# Altium schematic sheet Power.SchDoc
size A3; SheetNumber: 1; SheetTotal: 4
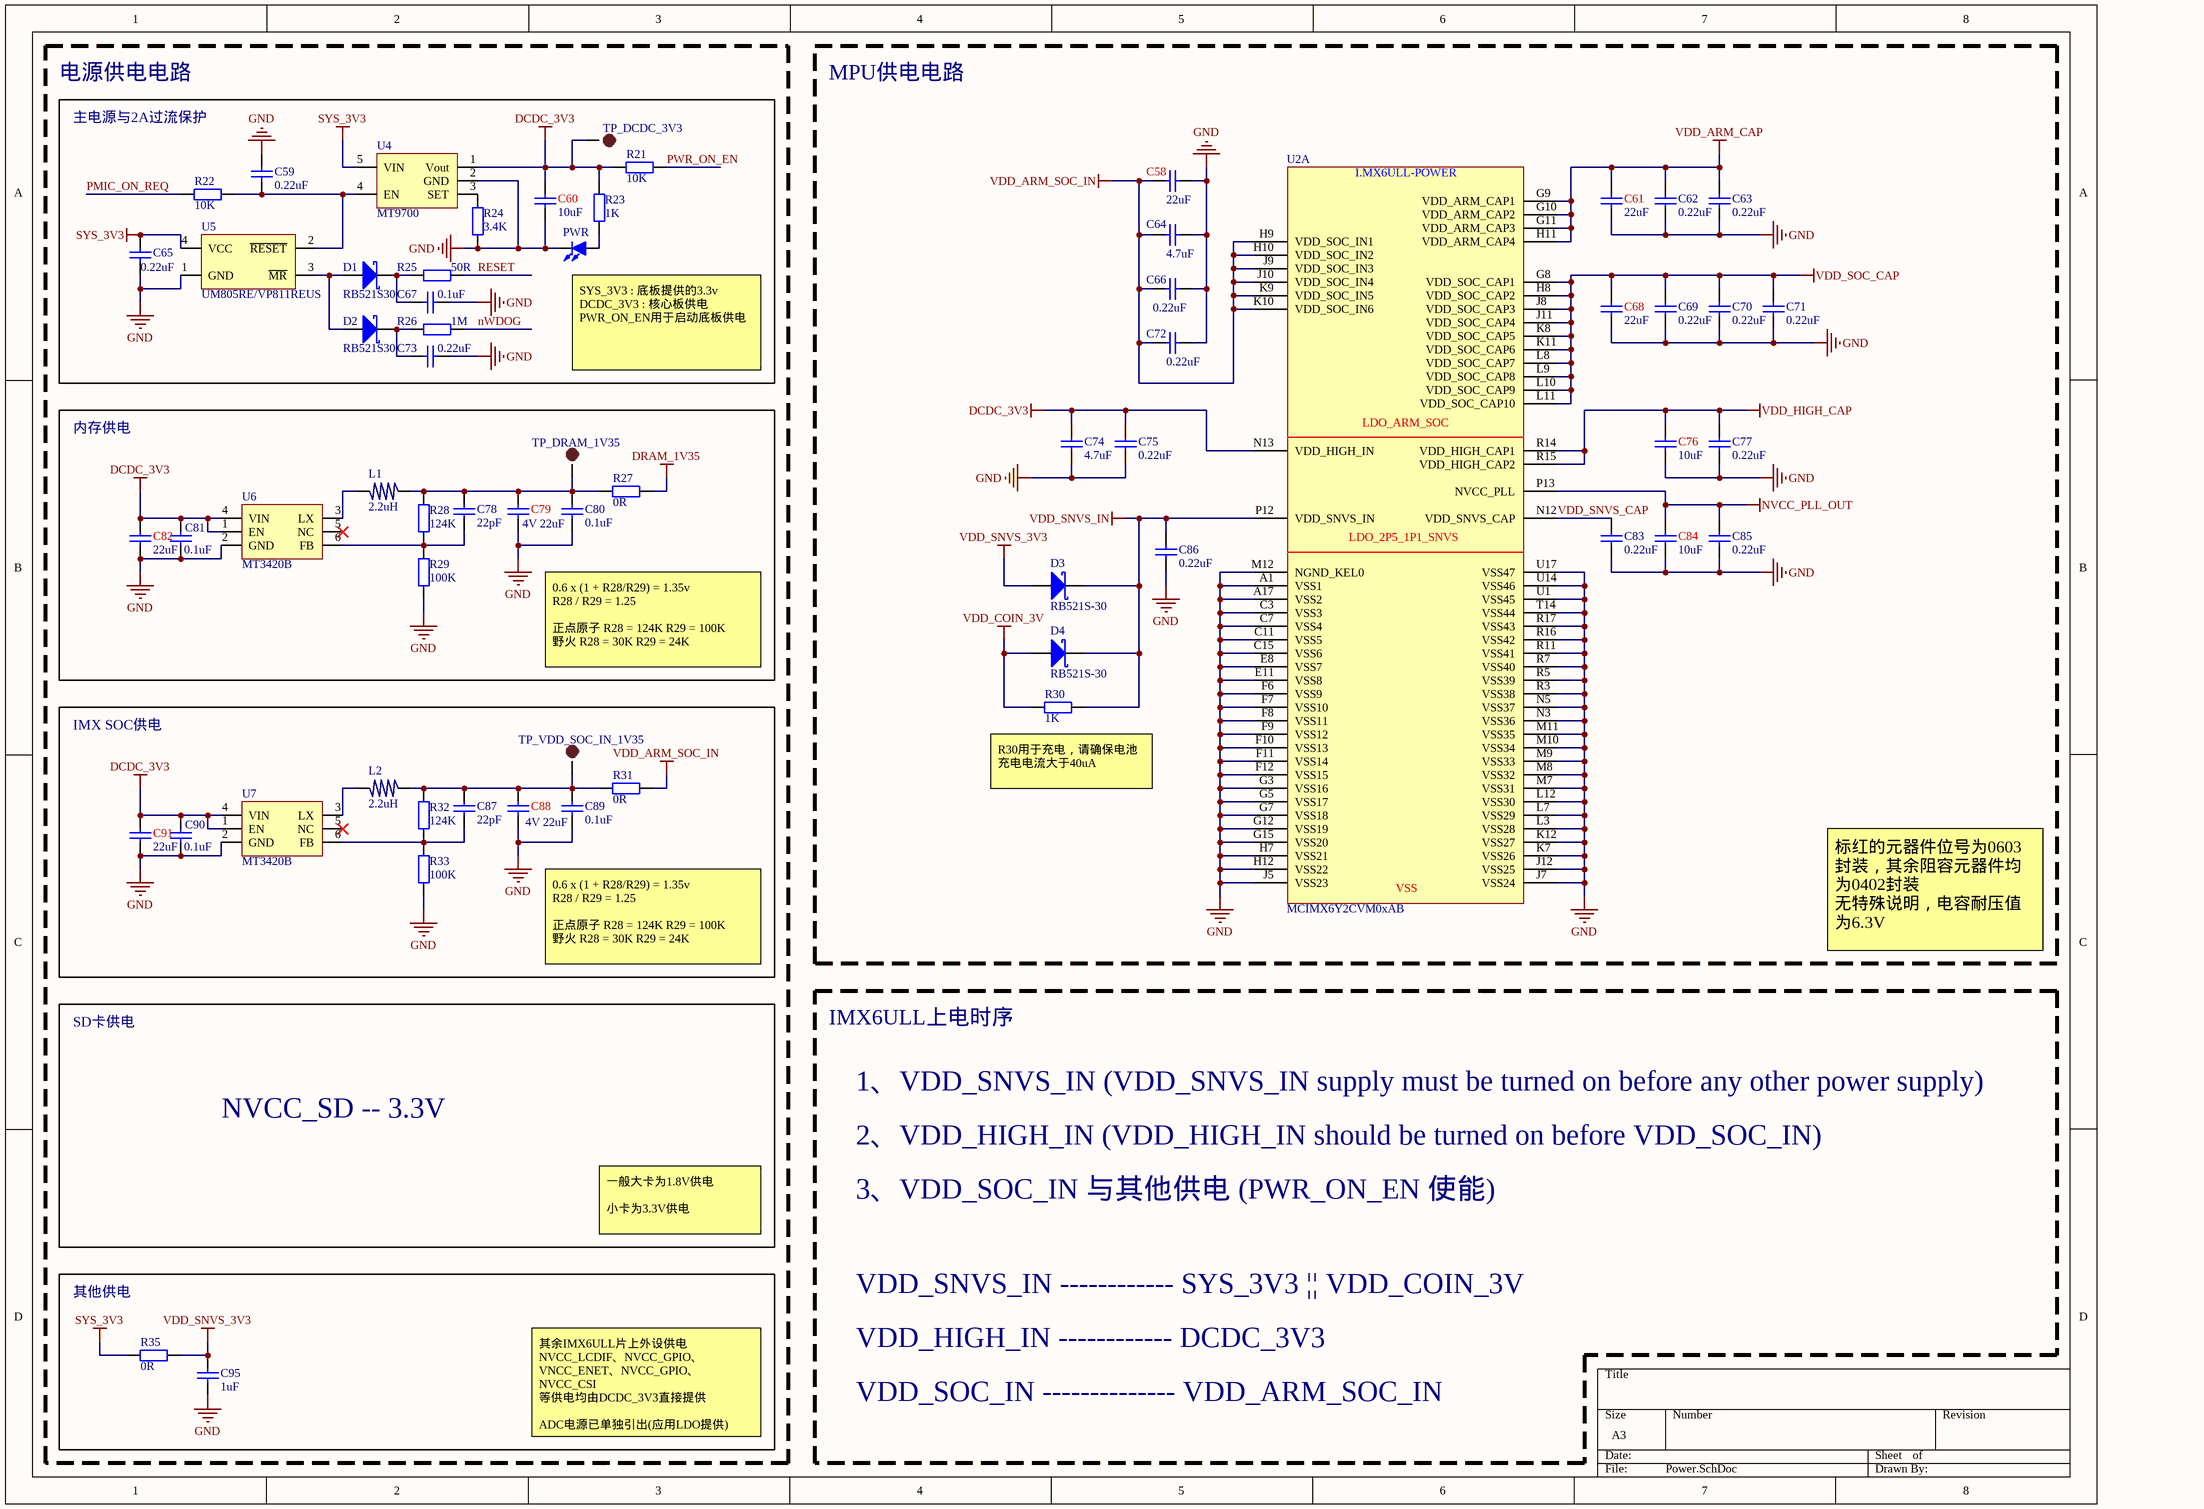
[diagram p0: Power.SchDoc]

## Parts
C58  22uF  [0603_C _MINI]
C59  0.22uF  [0402_C]
C60  10uF  [0603_C _MINI]
C61  22uF  [0603_C _MINI]
C62  0.22uF  [0402_C]
C63  0.22uF  [0402_C]
C64  4.7uF  [0402_C]
C65  0.22uF  [0402_C]
C66  0.22uF  [0402_C]
C67  0.1uF  [0402_C]
C68  22uF  [0603_C _MINI]
C69  0.22uF  [0402_C]
C70  0.22uF  [0402_C]
C71  0.22uF  [0402_C]
C72  0.22uF  [0402_C]
C73  0.22uF  [0402_C]
C74  4.7uF  [0402_C]
C75  0.22uF  [0402_C]
C76  10uF  [0603_C _MINI]
C77  0.22uF  [0402_C]
C78  22pF  [0402_C]
C79  4V 22uF  [0603_C _MINI]
C80  0.1uF  [0402_C]
C81  0.1uF  [0402_C]
C82  22uF  [0603_C _MINI]
C83  0.22uF  [0402_C]
C84  10uF  [0603_C _MINI]
C85  0.22uF  [0402_C]
C86  0.22uF  [0402_C]
C87  22pF  [0402_C]
C88  4V 22uF  [0603_C _MINI]
C89  0.1uF  [0402_C]
C90  0.1uF  [0402_C]
C91  22uF  [0603_C _MINI]
C95  1uF  [0402_C]
D1  RB521S30  [SOD-523]
D2  RB521S30  [SOD-523]
D3  RB521S-30  [SOD-523]
D4  RB521S-30  [SOD-523]
L1  2.2uH  [NR3015]
L2  2.2uH  [NR3015]
PWR  (no value)  [LED 0603B]
R21  10K  [0402_R]
R22  10K  [0402_R]
R23  1K  [0402_R]
R24  3.4K  [0402_R]
R25  50R  [0402_R]
R26  1M  [0402_R]
R27  0R  [0402_R]
R28  124K  [0402_R]
R29  100K  [0402_R]
R30  1K  [0402_R]
R31  0R  [0402_R]
R32  124K  [0402_R]
R33  100K  [0402_R]
R35  0R  [0402_R]
TP_DCDC_3V3  SOC_IN  [TP-1.0]  (value not drawn)
TP_DRAM_1V35  SOC_IN  [TP-1.0]  (value not drawn)
TP_VDD_SOC_IN_1V35  SOC_IN  [TP-1.0]  (value not drawn)
U2  MCIMX6Y2CVM0xAB  [BGA289_17x17_0.8Pitch]  (part A of 5)
U4  MT9700  [SOT23-5L]
U5  UM805RE/VP811REUS  [SOT143]
U6  MT3420B  [SOT23-6L]
U7  MT3420B  [SOT23-6L]

## Blocks framed on the sheet
MPU供电电路: C58 C61-C64 C66 C68-C72 C74-C77 C83-C86 D3 D4 R30 U2
电源供电电路: C59 C60 C65 C67 C73 D1 D2 PWR R21-R26 TP_DCDC_3V3 U4 U5
内存供电: C78-C82 L1 R27-R29 TP_DRAM_1V35 U6
IMX SOC供电: C87-C91 L2 R31-R33 TP_VDD_SOC_IN_1V35 U7
其他供电: C95 R35

## Nets
DCDC_3V3: C60.2 C74.2 C75.2 C81.2 C82.2 C90.2 C91.2 R21.1 R23.2 TP_DCDC_3V3.1 U2.N13(VDD_HIGH_IN) U4.1(Vout) U6.1(EN) U6.4(VIN) U7.1(EN) U7.4(VIN)
DRAM_1V35: R27.2
GND: C58.2 C59.2 C60.1 C61.1 C62.1 C63.1 C64.2 C65.1 C66.2 C67.2 C68.1 C69.1 C70.1 C71.1 C72.2 C73.2 C74.1 C75.1 C76.1 C77.1 C79.1 C80.1 C81.1 C82.1 C83.1 C84.1 C85.1 C86.1 C88.1 C89.1 C90.1 C91.1 C95.1 PWR.2(K) R24.2 R29.1 R33.1 U2.A1(VSS1) U2.A17(VSS2) U2.C3(VSS3) U2.C7(VSS4) U2.C11(VSS5) U2.C15(VSS6) U2.E8(VSS7) U2.E11(VSS8) U2.F6(VSS9) U2.F7(VSS10) U2.F8(VSS11) U2.F9(VSS12) U2.F10(VSS13) U2.F11(VSS14) U2.F12(VSS15) U2.G3(VSS16) U2.G5(VSS17) U2.G7(VSS18) U2.G12(VSS19) U2.G15(VSS20) U2.H7(VSS21) U2.H12(VSS22) U2.J5(VSS23) U2.J7(VSS24) U2.J12(VSS25) U2.K7(VSS26) U2.K12(VSS27) U2.L3(VSS28) U2.L7(VSS29) U2.L12(VSS30) U2.M7(VSS31) U2.M8(VSS32) U2.M9(VSS33) U2.M10(VSS34) U2.M11(VSS35) U2.M12(NGND_KEL0) U2.N3(VSS36) U2.N5(VSS37) U2.R3(VSS38) U2.R5(VSS39) U2.R7(VSS40) U2.R11(VSS41) U2.R16(VSS42) U2.R17(VSS43) U2.T14(VSS44) U2.U1(VSS45) U2.U14(VSS46) U2.U17(VSS47) U4.2(GND) U5.1(GND) U6.2(GND) U7.2(GND)
NVCC_PLL_OUT: C84.2 C85.2 U2.P13(NVCC_PLL)
SYS_3V3: C65.2 R35.1 U4.5(VIN) U5.4(VCC)
VDD_ARM_CAP: C61.2 C62.2 C63.2 U2.G9(VDD_ARM_CAP1) U2.G10(VDD_ARM_CAP2) U2.G11(VDD_ARM_CAP3) U2.H11(VDD_ARM_CAP4)
VDD_ARM_SOC_IN: C58.1 C64.1 C66.1 C72.1 R31.2 U2.H9(VDD_SOC_IN1) U2.H10(VDD_SOC_IN2) U2.J9(VDD_SOC_IN3) U2.J10(VDD_SOC_IN4) U2.K9(VDD_SOC_IN5) U2.K10(VDD_SOC_IN6)
VDD_COIN_3V: D4.1(A) R30.1
VDD_HIGH_CAP: C76.2 C77.2 U2.R14(VDD_HIGH_CAP1) U2.R15(VDD_HIGH_CAP2)
VDD_SNVS_3V3: C95.2 D3.1(A) R35.2
VDD_SNVS_IN: C86.2 D3.2(C) D4.2(C) R30.2 U2.P12(VDD_SNVS_IN)
VDD_SOC_CAP: C68.2 C69.2 C70.2 C71.2 U2.G8(VDD_SOC_CAP1) U2.H8(VDD_SOC_CAP2) U2.J8(VDD_SOC_CAP3) U2.J11(VDD_SOC_CAP4) U2.K8(VDD_SOC_CAP5) U2.K11(VDD_SOC_CAP6) U2.L8(VDD_SOC_CAP7) U2.L9(VDD_SOC_CAP8) U2.L10(VDD_SOC_CAP9) U2.L11(VDD_SOC_CAP10)
nWDOG: R26.2
PMIC_ON_REQ: R22.1
PWR_ON_EN: R21.2
RESET: R25.2
VDD_SNVS_CAP: C83.2 U2.N12(VDD_SNVS_CAP)
NetC59_1: C59.1 R22.2 U4.4(EN) U5.2(~{RESET})
NetC67_1: C67.1 D1.2(C) R25.1
NetC73_1: C73.1 D2.2(C) R26.1
NetC78_1: C78.1 R28.1 R29.2 U6.6(FB)
NetC78_2: C78.2 C79.2 C80.2 L1.1 R27.1 R28.2 TP_DRAM_1V35.1
NetC87_1: C87.1 R32.1 R33.2 U7.6(FB)
NetC87_2: C87.2 C88.2 C89.2 L2.1 R31.1 R32.2 TP_VDD_SOC_IN_1V35.1
NetD1_1: D1.1(A) D2.1(A) U5.3(~{MR})
NetL1_2: L1.2 U6.3(LX)
NetL2_2: L2.2 U7.3(LX)
NetPWR_1: PWR.1(A) R23.1
NetR24_1: R24.1 U4.3(SET)

Not connected (* = marked no-connect by the designer): U6 5(NC)*; U7 5(NC)*

## Notes on the sheet
- 主电源与2A过流保护
- (near PWR) SYS_3V3 : 底板提供的3.3v
  DCDC_3V3 : 核心板供电
  PWR_ON_EN用于启动底板供电
- 0.6 x (1 + R28/R29) = 1.35v
  R28 / R29 = 1.25
  正点原子 R28 = 124K R29 = 100K
  野火 R28 = 30K R29 = 24K
- (near R30) R30用于充电，请确保电池充电电流大于40uA
- 标红的元器件位号为0603封装，其余阻容元器件均为0402封装
  无特殊说明，电容耐压值为6.3V
- SD卡供电
- IMX6ULL上电时序
- NVCC_SD -- 3.3V
- 1、VDD_SNVS_IN (VDD_SNVS_IN supply must be turned on before any other power supply)
- 2、VDD_HIGH_IN (VDD_HIGH_IN should be turned on before VDD_SOC_IN)
- 一般大卡为1.8V供电
  小卡为3.3V供电
- 3、VDD_SOC_IN 与其他供电 (PWR_ON_EN 使能)
- VDD_SNVS_IN ------------ SYS_3V3 || VDD_COIN_3V
- VDD_HIGH_IN ------------ DCDC_3V3
- 其余IMX6ULL片上外设供电
  NVCC_LCDIF、NVCC_GPIO、
  VNCC_ENET、NVCC_GPIO、
  NVCC_CSI
  等供电均由DCDC_3V3直接提供
  ADC电源已单独引出(应用LDO提供)
- VDD_SOC_IN -------------- VDD_ARM_SOC_IN
- (in symbol MCIMX6Y2CVM0xAB, part A) I.MX6ULL-POWER; LDO_ARM_SOC; LDO_2P5_1P1_SNVS; VSS

## Library data of the parts
C58 C60 C61 C68 C76 C79 C82 C84 C88 C91 = 0603_C_MINI: 贴片电容; ComponentLink1Description: 供应商链接; ComponentLink1URL: http://www.szlcsc.com/product/details_2037.html; Package: 0603; Supplier: LC; SuppliersPartNumber: C1685
C59 C62-C67 C69-C75 C77 C78 C80 C81 C83 C85-C87 C89 C90 C95 = 0402_C: 贴片电容; ComponentLink1Description: 供应商链接; ComponentLink1URL: http://www.szlcsc.com/product/details_1928.html; Package: 0402; Supplier: LC; SuppliersPartNumber: C1576
D3 D4 = RB521S30
L1 L2 = L
PWR = 0603_LED_B: 贴片LED; 版权归属: 源创客; BOM名称: 贴片LED; 学习资源: www.ooocke.com
R21-R33 R35 = 0402_R: 贴片电阻; ComponentLink1Description: 供应商链接; ComponentLink1URL: http://www.szlcsc.com/product/details_26667.html; Package: 0402; Supplier: LC; SuppliersPartNumber: C25924
TP_DCDC_3V3 TP_DRAM_1V35 TP_VDD_SOC_IN_1V35 = TEST-POINT: 测试点
U4 = MT9700: 负载开关
U5 = UM805RE/VP811REUS: 复位芯片
U6 U7 = MT3420B: DCDC